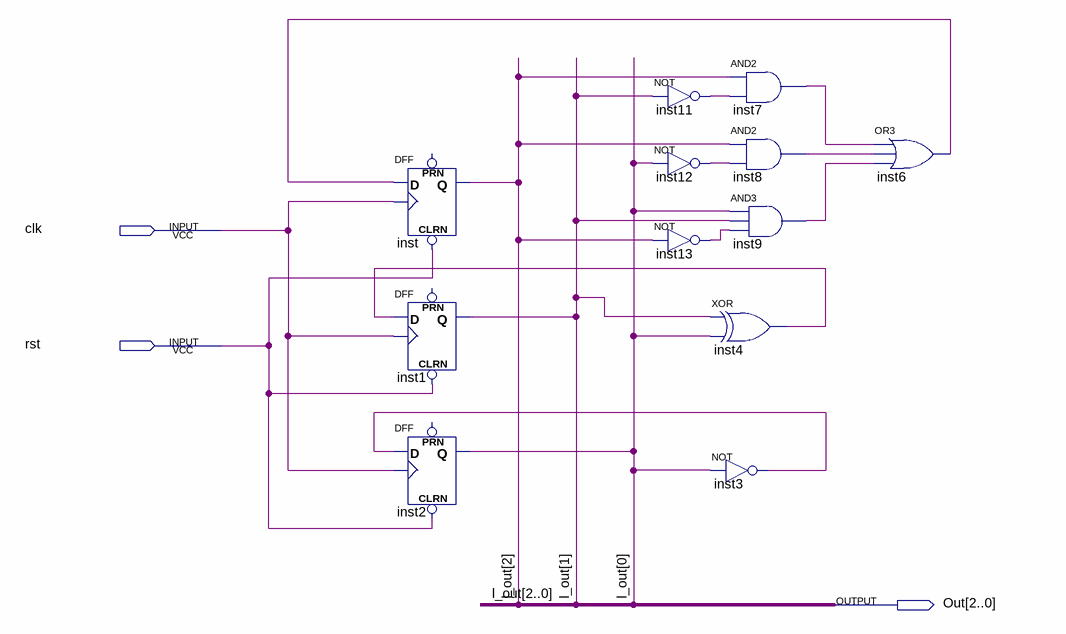
[diagram p0: schematic sheet]
// Quartus schematic count_8.bdf as structural Verilog: 12 symbols, 3 pins
module count_8 (
  input  clk,
  input  rst,
  output [2:0] Out
);

  wire inst3_out, inst4_out, inst6_out, inst7_out, inst8_out, inst9_out, inst11_out, inst12_out, inst13_out;

  DFF inst (.CLRN(rst), .CLK(clk), .D(inst6_out), .Q(Out[2]));  // open: PRN
  DFF inst1 (.CLRN(rst), .CLK(clk), .D(inst4_out), .Q(Out[1]));  // open: PRN
  DFF inst2 (.CLRN(rst), .CLK(clk), .D(inst3_out), .Q(Out[0]));  // open: PRN
  not inst11 (inst11_out, Out[1]);
  not inst12 (inst12_out, Out[0]);
  not inst13 (inst13_out, Out[2]);
  and inst7 (inst7_out, Out[2], inst11_out);
  and inst8 (inst8_out, Out[2], inst12_out);
  and inst9 (inst9_out, Out[0], Out[1], inst13_out);
  xor inst4 (inst4_out, Out[1], Out[0]);
  not inst3 (inst3_out, Out[0]);
  or inst6 (inst6_out, inst7_out, inst8_out, inst9_out);

  // Other names for the same wires on the sheet: l_out[2:0] = Out
endmodule
